# EAGLE schematic PCB_Sensor (EAGLE 6.5.0)
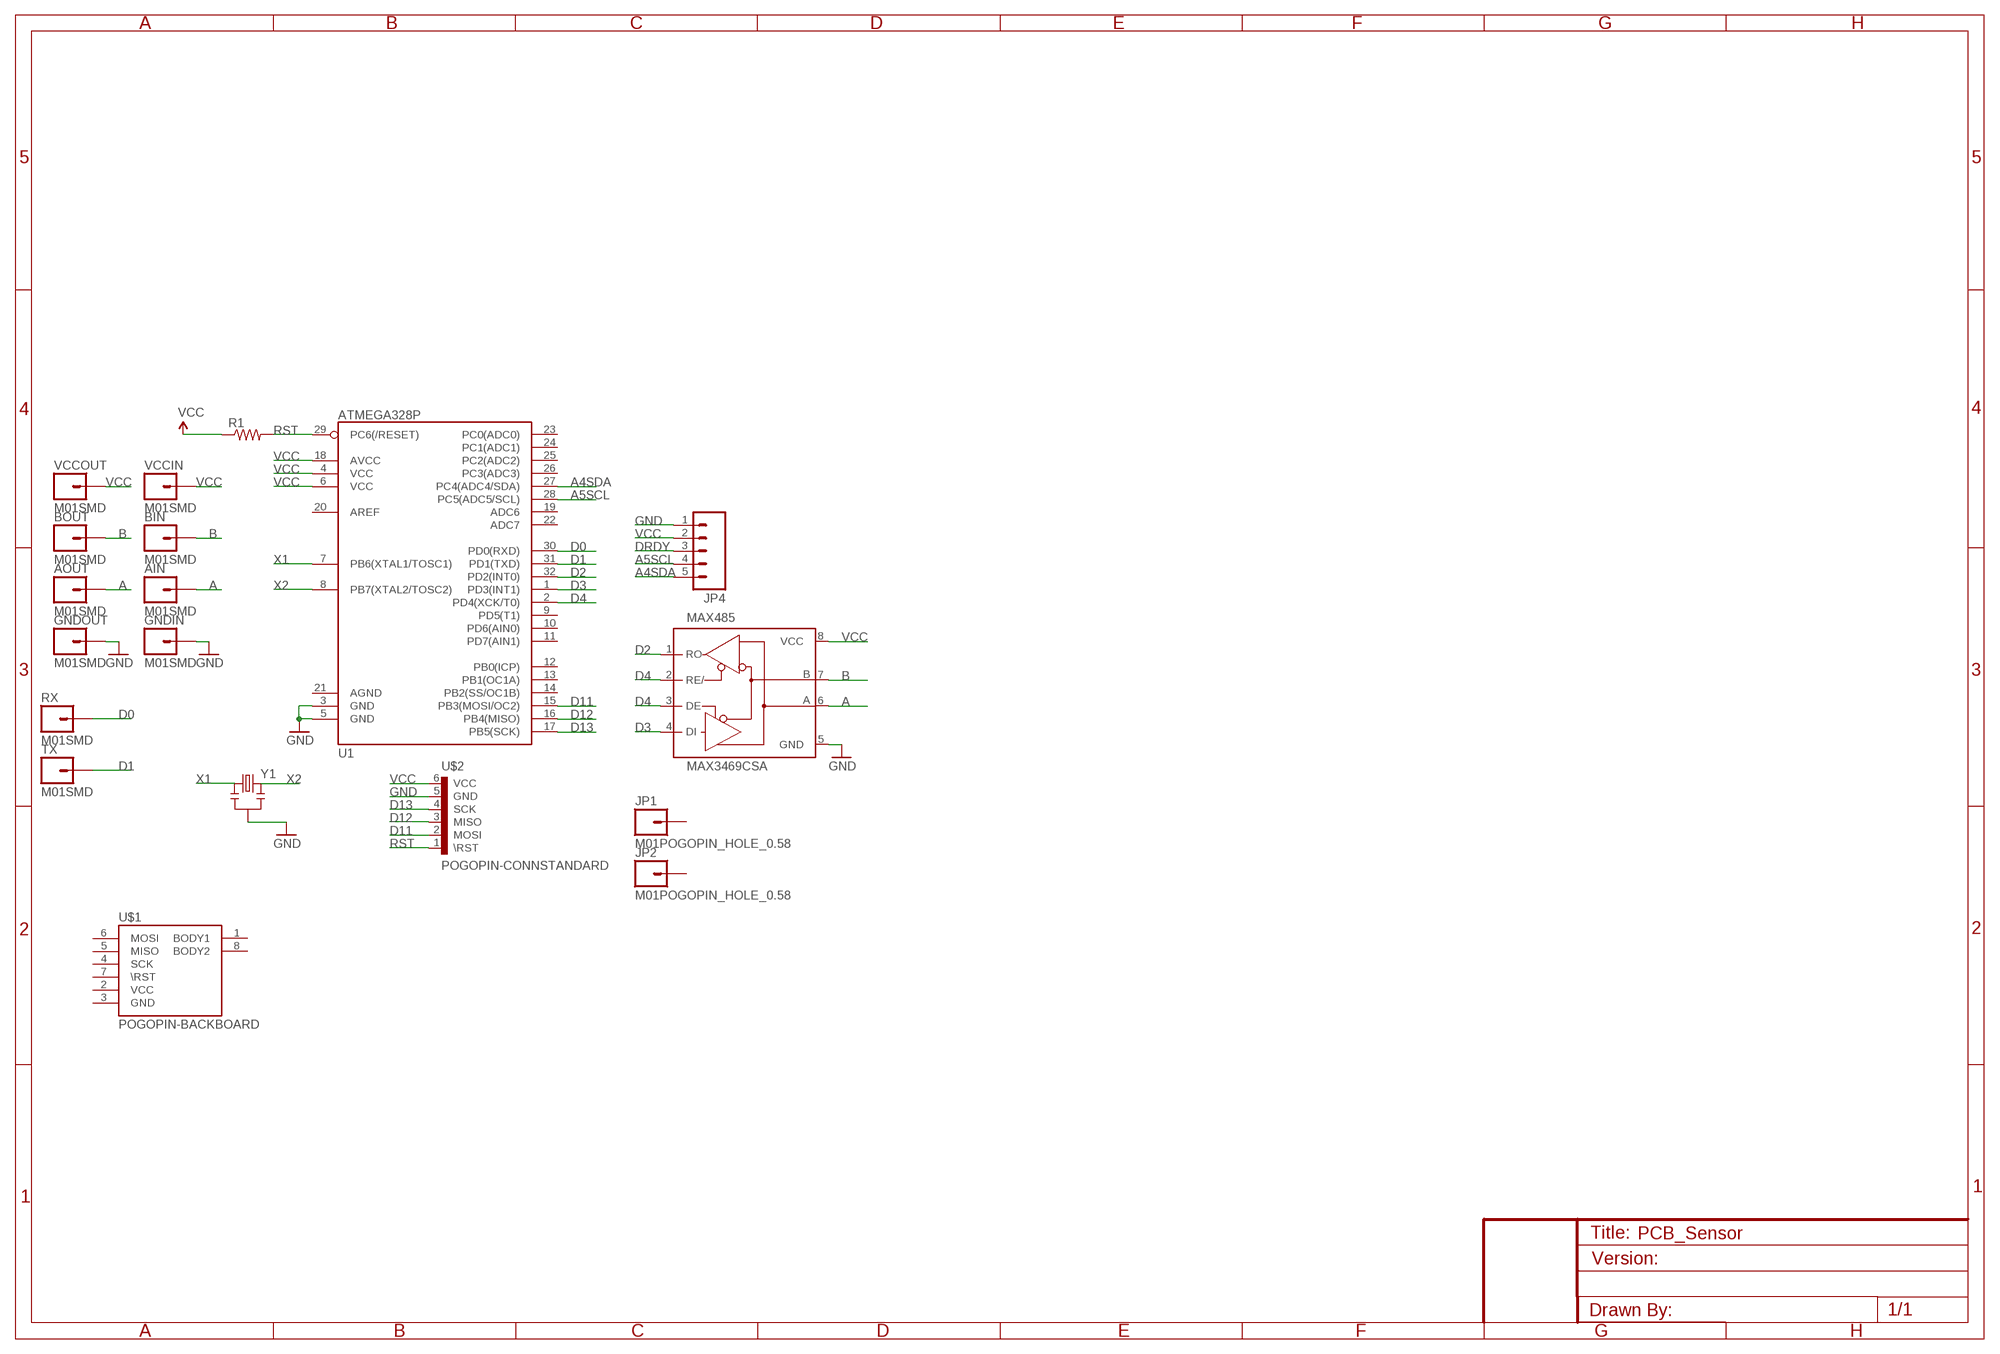
[diagram p0: schematic, sheet 1]

## Parts
AIN  M01SMD  [LUXEON-PAD]
AOUT  M01SMD  [LUXEON-PAD]
BIN  M01SMD  [LUXEON-PAD]
BOUT  M01SMD  [LUXEON-PAD]
GNDIN  M01SMD  [LUXEON-PAD]
GNDOUT  M01SMD  [LUXEON-PAD]
JP1  M01POGOPIN_HOLE_0.58  [1X01_POGOPIN_HOLE_0.58]
JP2  M01POGOPIN_HOLE_0.58  [1X01_POGOPIN_HOLE_0.58]
JP4  M05PTH  [1X05]
MAX485  MAX3469CSA  [SO08]
R1  RESISTOR1206  [1206]
RX  M01SMD  [LUXEON-PAD]
TX  M01SMD  [LUXEON-PAD]
U1  ATMEGA328P  ATMEGA328_SMT  [TQFP32-08]
U$1  POGOPIN-BACKBOARD  [POGOPROG-BACKMOUNT]
U$2  POGOPIN-CONNSTANDARD  [POGOPROG-CONN]
VCCIN  M01SMD  [LUXEON-PAD]
VCCOUT  M01SMD  [LUXEON-PAD]
Y1  RESONATORPTH  [RESONATOR-PTH]

## Nets
A: AIN.P$1 MAX485.6(A)
A4SDA: JP4.5 U1.27(PC4(ADC4/SDA))
A5SCL: JP4.4 U1.28(PC5(ADC5/SCL))
B: BIN.P$1 MAX485.7(B)
D0: U1.30(PD0(RXD))
D1: U1.31(PD1(TXD))
D2: MAX485.1(RO) U1.32(PD2(INT0))
D3: MAX485.4(DI) U1.1(PD3(INT1))
D4: MAX485.2(RE/) MAX485.3(DE) U1.2(PD4(XCK/T0))
D11: U1.15(PB3(MOSI/OC2)) U$2.2(MOSI)
D12: U1.16(PB4(MISO)) U$2.3(MISO)
D13: U1.17(PB5(SCK)) U$2.4(SCK)
DRDY: JP4.3
GND: GNDIN.P$1 JP4.1 MAX485.5(GND) U1.3(GND) U1.5(GND) U$2.5(GND) Y1.2
RST: R1.2 U1.29(PC6(/RESET)) U$2.1(\RST)
VCC: JP4.2 MAX485.8(VCC) R1.1 U1.4(VCC) U1.6(VCC) U1.18(AVCC) U$2.6(VCC) VCCIN.P$1 VCCOUT.P$1
X1: U1.7(PB6(XTAL1/TOSC1)) Y1.1
X2: U1.8(PB7(XTAL2/TOSC2)) Y1.3
Unconnected: AOUT.P$1 BOUT.P$1 GNDOUT.P$1 JP1.1 JP2.1 RX.P$1 TX.P$1 U1.9(PD5(T1)) U1.10(PD6(AIN0)) U1.11(PD7(AIN1)) U1.12(PB0(ICP)) U1.13(PB1(OC1A)) U1.14(PB2(SS/OC1B)) U1.19(ADC6) U1.20(AREF) U1.21(AGND) U1.22(ADC7) U1.23(PC0(ADC0)) U1.24(PC1(ADC1)) U1.25(PC2(ADC2)) U1.26(PC3(ADC3)) U$1.1(BODY1) U$1.2(VCC) U$1.3(GND) U$1.4(SCK) U$1.5(MISO) U$1.6(MOSI) U$1.7(\RST) U$1.8(BODY2)

## Library data of the parts
AIN AOUT BIN BOUT GNDIN GNDOUT JP1 JP2 RX TX VCCIN VCCOUT = SparkFun-Connectors:M01: Header 1 Standard 1-pin 0.1" header. Use with straight break away headers (SKU : PRT-00116), right angle break away headers (PRT-00553), swiss pins (PRT-00743), machine pins (PRT-00117), and female headers (PRT-00115).
JP4 = SparkFun-Connectors:M05: Header 5 Standard 5-pin 0.1" header. Use with straight break away headers (SKU : PRT-00116), right angle break away headers (PRT-00553), swiss pins (PRT-00743), machine pins (PRT-00117), and female headers (PRT-00115). Molex polarized connector foot print use with SKU : PRT-08230 with associated crimp pins and housings.
MAX485 = maxim:MAX34*: +5V, Fail-Safe, 40Mbps, Profibus RS-485/RS-422 Transceivers Source: MAX3465-MAX3469.pdf; MPN: MAX3469CSA+; OC_FARNELL: unknown; OC_NEWARK: 05M8548
R1 = SparkFun-Passives:RESISTOR: Resistor Basic schematic elements and footprints for 0603, 1206, and PTH resistors.
U1 = SparkFun-DigitalIC:ATMEGA328_SMT: 32-Pin Atmega328 part Commonly used on Arduino compatible boards Available in QFP and QFN packages TQFP is IC-09069 QFN is non-stock; PROD_ID: IC-09069
U$1 = Protofusion:POGOPIN-BACKBOARD
U$2 = Protofusion:POGOPIN-CONN: Protofusion custom pogo pin programming header
Y1 = SparkFun-FreqCtrl:RESONATOR: Resonator Small SMD resonator. Used, eg, on the Arduino Pro/ Pro Mini boards. 8MHz- XTAL-08895 16MHz- XTAL-08900